# EAGLE board GTM900-breakout_v3 (EAGLE 7.7.0)
VERSION: v3
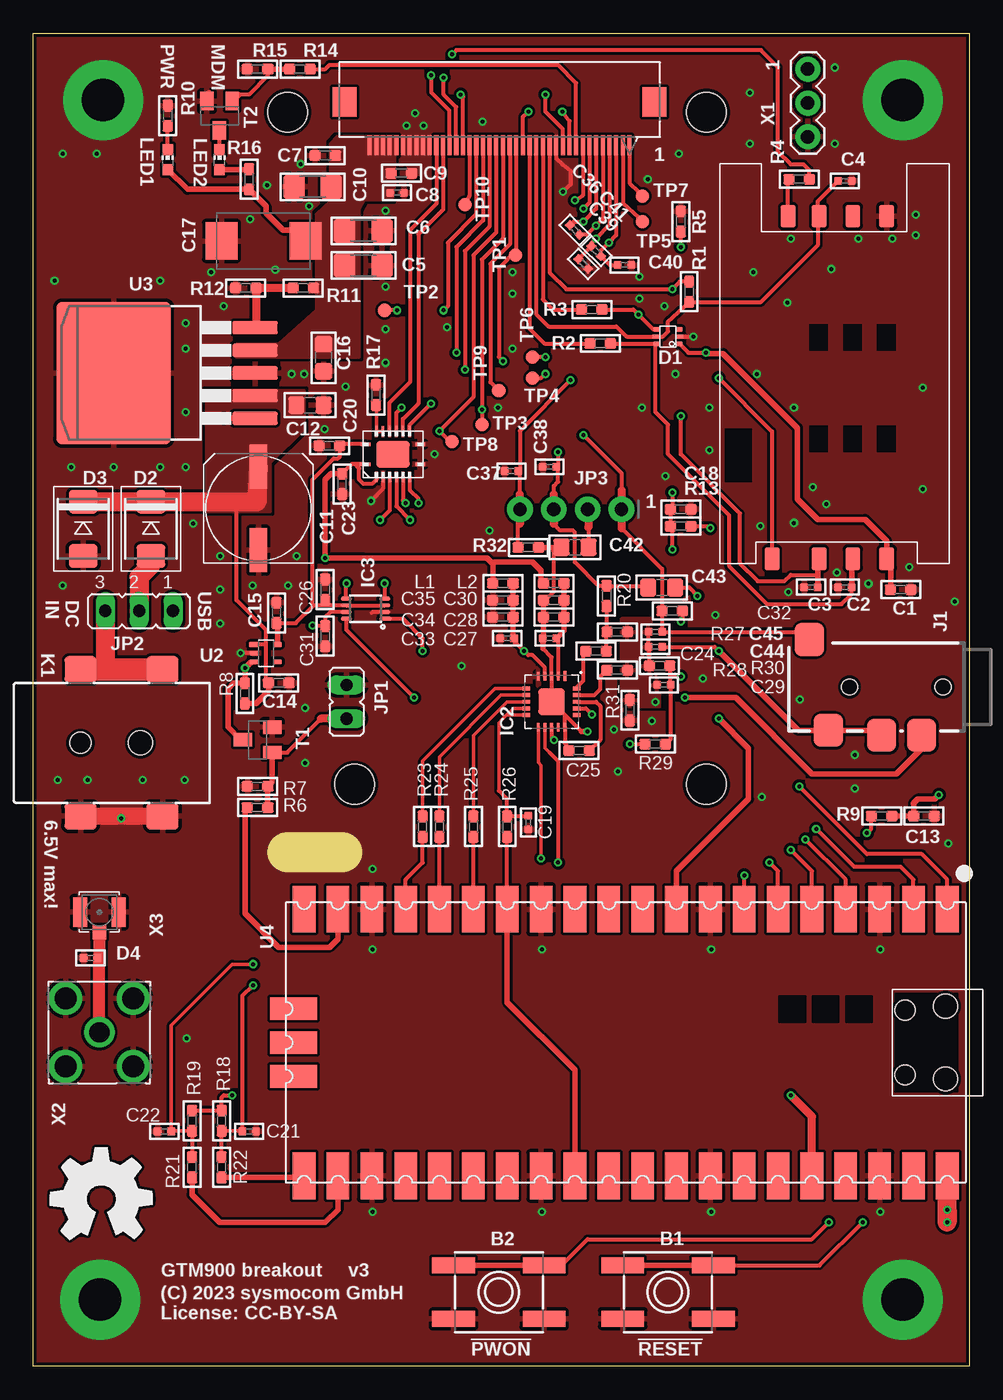
[diagram p2: board, top side]
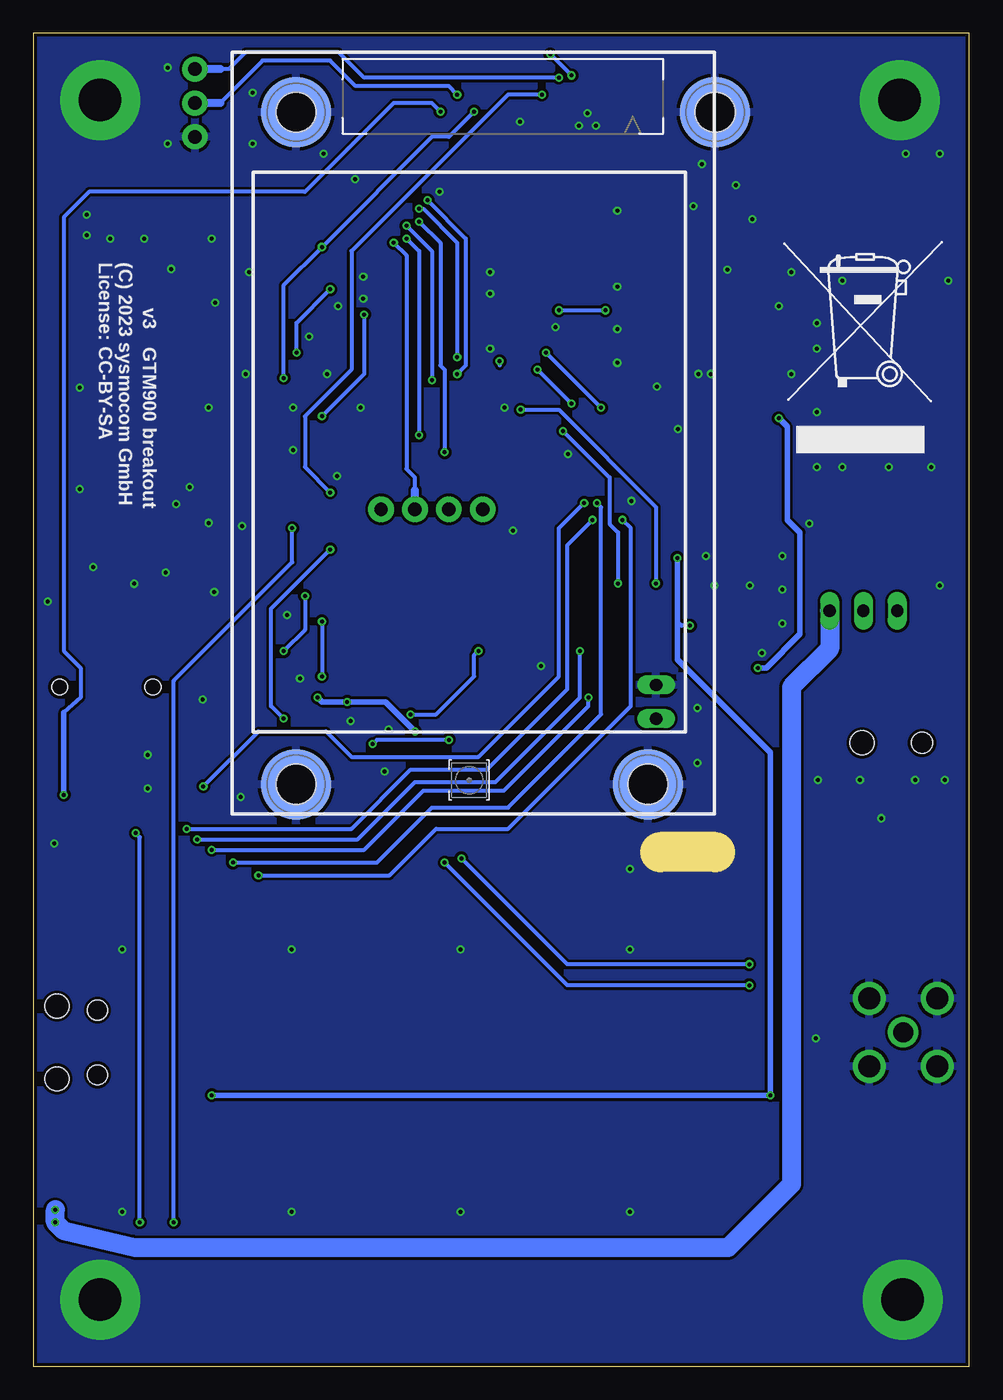
[diagram p3: board, bottom side, seen from below]

Size 70.23 x 100 mm. Coordinates in mm from the lower left corner, seen from the top.
Outline: 70.23,0 0,0 0,100 70.23,100 70.23,0
Copper layers (1*16): Top 0.035mm / dielectric 1.5mm / Bottom 0.035mm
Design rules "SeeedStudio_2layer_DRU_no_angle_20140221 *": minimum track width 6mil, minimum drill 0.3mm, track to track 6mil, track to pad 6mil, pad to pad 6mil, via to via 6mil, smd to smd 0mil, copper to edge 10mil, drill to drill 10mil, minimum pad ring 10mil, minimum via ring 6mil, stop-mask expansion 2mil, vias tented up to drill 100mil, thermal gap 10mil
Net classes: 1 usb: width 0.5 mm, drill 0.15 mm; 2 50 ohm: width 0.9 mm, clearance 0.152 mm; 3 supply: width 0.6 mm, clearance 0.203 mm
Milling: 1 lines

## Footprints (pad centres in the part's own frame; a part is rotated, then mirrored left to right if it is on the bottom)
EVQ-Q2 = smd 3.2 x 1.2: A -3.4,-2; A' 3.4,-2; B -3.4,2; B' 3.4,2
_0603 = smd 0.9 x 0.8: 1 -0.762,0; 2 0.762,0
_0402 = smd 0.6 x 0.6: 1 -0.508,0; 2 0.508,0
1206 = smd 1.6 x 1.8: 1 -1.4,0; 2 1.4,0
UD-8X10_NICHICON = smd 3.3 x 1.3: + 3.125,0; - -3.125,0
_0805 = smd 1.2 x 1.3: 1 -1.016,0; 2 1.016,0
SMC_E = smd 2.4 x 2.8: + -3.15,0; - 3.15,0
SOT666 = smd 0.375 x 0.5: 1 -0.538,-0.85; 3 0.538,-0.85; 4 0.538,0.85; 6 -0.538,0.85 | smd 0.3 x 0.6: 2 0,-0.9; 5 0,0.9
SMBDIODE = smd 1.78 x 2.16: A 2.04,0; C -2.03,0
VQFN-N16 = smd 0.9 x 0.28: 1 -2.091,-0.75 | smd 0.28 x 0.8: 2 -1.25,-1.7; 3 -0.75,-1.7; 4 -0.25,-1.7; 5 0.25,-1.7; 6 0.75,-1.7; 7 1.25,-1.7; 10 1.25,1.7; 11 0.75,1.7; 12 0.25,1.7; 13 -0.25,1.7; 14 -0.75,1.7; 15 -1.25,1.7 | smd 0.8 x 0.28: 8 2.041,-0.75; 9 2.041,0.75; 16 -2.041,0.75 | smd 2.5 x 2: EXP 0,0
QFN20 = smd 0.75 x 0.3: 1 -1.94,1 | smd 0.65 x 0.3: 2 -1.9,0.5; 3 -1.9,0; 4 -1.9,-0.5; 5 -1.9,-1; 11 1.9,-1; 12 1.9,-0.5; 13 1.9,0; 14 1.9,0.5; 15 1.9,1 | smd 0.3 x 0.65: 6 -1,-1.9; 7 -0.5,-1.9; 8 0,-1.9; 9 0.5,-1.9; 10 1,-1.9; 16 1,1.9; 17 0.5,1.9; 18 0,1.9; 19 -0.5,1.9; 20 -1,1.9 | smd 2 x 2: EXP 0,0
VSSOP-8 = smd 0.3 x 0.95: 1 -0.75,-1.5 | smd 0.3 x 0.85: 2 -0.25,-1.45; 3 0.25,-1.45; 4 0.75,-1.45; 5 0.75,1.45; 6 0.25,1.45; 7 -0.25,1.45; 8 -0.75,1.45
AUDIO-JACK-TRRS-SMD = smd 2.2 x 2.5: 1 11.617,-3.567; 2 10.2,3.25; 3 6.2,3.618; 4 3.2,3.618 | hole 1.2: 1.6,0; 8.6,0
JP1 = drill 0.914 long: 1 0,-1.27; 2 0,1.27
JP2 = drill 0.914 long: 1 -2.54,0; 2 0,0; 3 2.54,0
1X04_ROUND_76 = drill 1 pad 1.93: 1 -3.81,0; 2 -1.27,0; 3 1.27,0; 4 3.81,0
694108106102 = smd 2.4 x 2: 1 11.15,5.5; 1-1 5,5.5; 2 5,-5.5; 3 11.15,-5.5 | hole 1.6: 5,0 | hole 1.8: 9.5,0
CHIP-LED0603 = smd 0.8 x 0.8: A 0,-0.75; C 0,0.75
GTM900-WRTHSPACER = smd 5.3 x 5.3: 1 4.5,36.233; 2 4.5,4.8; 3 54.928,31.2; 4 54.928,4.8 | hole 3: 4.5,36.233; 4.5,4.8; 54.928,31.2; 54.928,4.8
SF7W008S1A-RESTR = smd 1.7 x 1.1: 1 12.85,3.9; 2 12.85,1.36; 3 12.85,-1.18; 5 -12.85,3.9; 6 -12.85,1.36; 7 -12.85,-1.18; 81 12.85,-4.7; 82 -12.85,-3.5
SOT23-BEC = smd 1 x 1.4: B -0.95,-1.1; C 0,1.1; E 0.95,-1.1
TP10R = smd 1 x 1: TP 0,0
HIROSE_FH12A-40S-0.5SH(55) = smd 0.305 x 1.499: 1 9.754,3.429; 2 9.246,3.429; 3 8.738,3.429; 4 8.255,3.429; 5 7.747,3.429; 6 7.239,3.429; 7 6.756,3.429; 8 6.248,3.429; 9 5.74,3.429; 10 5.258,3.429; 11 4.75,3.429; 12 4.242,3.429; 13 3.759,3.429; 14 3.251,3.429; 15 2.743,3.429; 16 2.261,3.429; 17 1.753,3.429; 18 1.245,3.429; 19 0.762,3.429; 20 0.254,3.429; 21 -0.254,3.429; 22 -0.762,3.429; 23 -1.245,3.429; 24 -1.753,3.429; 25 -2.261,3.429; 26 -2.743,3.429; 27 -3.251,3.429; 28 -3.759,3.429; 29 -4.242,3.429; 30 -4.75,3.429; 31 -5.258,3.429; 32 -5.74,3.429; 33 -6.248,3.429; 34 -6.756,3.429; 35 -7.239,3.429; 36 -7.747,3.429; 37 -8.255,3.429; 38 -8.738,3.429; 39 -9.246,3.429; 40 -9.754,3.429 | smd 1.803 x 2.21: 41 -11.633,6.68; 42 11.633,6.68
SC70-5 = smd 0.4 x 0.8: 1 -0.65,-0.9 | smd 0.4 x 0.7: 2 0,-0.85; 3 0.65,-0.85; 4 0.65,0.85; 5 -0.65,0.85
TI_KTT_DPAK2 = smd 1 x 3.4: 1 -3.4,-10.6; 2 -1.7,-10.6; 3 0,-10.6; 4 1.7,-10.6; 5 3.4,-10.6 | smd 10.7 x 8.6: PAD 0,0
PICO-PKG-SMD = smd 3.5 x 1.7: P$1 -10,24.13; P$2 -10,21.59; P$3 -10,19.05; P$4 -10,16.51; P$5 -10,13.97; P$6 -10,11.43; P$7 -10,8.89; P$8 -10,6.35; P$9 -10,3.81; P$10 -10,1.27; P$11 -10,-1.27; P$12 -10,-3.81; P$13 -10,-6.35; P$14 -10,-8.89; P$15 -10,-11.43; P$16 -10,-13.97; P$17 -10,-16.51; P$18 -10,-19.05; P$19 -10,-21.59; P$20 -10,-24.13; P$21 10,-24.13; P$22 10,-21.59; P$23 10,-19.05; P$24 10,-16.51; P$25 10,-13.97; P$26 10,-11.43; P$27 10,-8.89; P$28 10,-6.35; P$29 10,-3.81; P$30 10,-1.27; P$31 10,1.27; P$32 10,3.81; P$33 10,6.35; P$34 10,8.89; P$35 10,11.43; P$36 10,13.97; P$37 10,16.51; P$38 10,19.05; P$39 10,21.59; P$40 10,24.13 | smd 1.7 x 3.5: P$41 -2.54,-24.925; P$42 0,-24.925; P$43 2.54,-24.925 | hole 1.8: -2.725,24; 2.725,24 | hole 1.5: -2.425,20.97; 2.425,20.97
1X03 = drill 1.016 pad 1.88: 1 0,0; 2 2.54,0; 3 5.08,0
SMA-F-S-TH = drill 1.524: C 0,0 | drill 1.651: G1 -2.54,2.54; G2 2.54,2.54; G3 -2.54,-2.54; G4 2.54,-2.54
HRS_UFL = smd 1.05 x 2.2: GND@1 -1.452,0; GND@2 1.452,0 | smd 1 x 1.05: SIG 0,-1.502

## Placement (x,y rotation side)
B1  [EVQ-Q2]  47.62,5.56 180 top
B2  [EVQ-Q2]  34.92,5.55 180 top
C1  100n  [_0603]  65.09,58.26 180 top
C2  33p  [_0402]  60.9,58.45 180 top
C3  33p  [_0402]  58.36,58.45 180 top
C4  33p  [_0402]  60.9,88.93 0 top
C5  100u  [1206]  24.77,82.58 180 top
C6  100u  [1206]  24.77,85.18 180 top
C7  100n  [_0603]  21.91,90.83 0 top
C8  33p  [_0402]  27.3,88.04 0 top
C9  10p  [_0603]  27.62,89.5 0 top
C10  100u  [1206]  20.95,88.48 0 top
C11  470u  [UD-8X10_NICHICON]  16.89,64.35 90 top
C12  10u  [_0805]  20.76,72.1 180 top
C13  100n  [_0603]  66.83,41.27 0 top
C14  1u  [_0603]  18.41,51.27 180 top
C15  1u  [_0603]  18.25,56.52 270 top
C16  10u  [_0805]  21.78,75.66 90 top
C17  DNP  [SMC_E]  17.27,84.42 180 top
C18  100n  [_0603]  48.58,64.29 0 top
C19  33p  [_0402]  37.15,40.8 270 top
C20  100n  [_0603]  22.23,69.05 180 top
C21  33p  [_0402]  16.2,17.62 0 top
C22  33p  [_0402]  9.84,17.62 180 top
C23  100n  [_0603]  23.18,66.19 90 top
C24  100n  [_0603]  42.23,53.65 0 top
C25  4.7u  [_0603]  40.96,46.19 0 top
C26  100n  [_0603]  21.91,58.27 90 top
C27  33p  [_0402]  38.73,54.61 180 top
C28  100n  [_0603]  39.05,56.2 180 top
C29  33p  [_0402]  47.31,51.12 180 top
C30  4.7u  [_0603]  39.05,57.47 180 top
C31  100n  [_0603]  21.91,54.77 90 top
C32  100n  [_0603]  47.94,56.67 0 top
C33  33p  [_0402]  35.56,54.61 180 top
C34  100n  [_0603]  35.24,56.2 180 top
C35  4.7u  [_0603]  35.24,57.47 180 top
C36  33p  [_0402]  40.64,85.25 135 top
C37  33p  [_0402]  38.73,67.47 180 top
C38  33p  [_0402]  35.88,67.16 0 top
C39  33p  [_0402]  41.27,82.7 315 top
C40  33p  [_0402]  44.36,82.61 0 top
C41  33p  [_0402]  42.23,83.66 315 top
C42  10u  [_0805]  40.64,61.44 180 top
C43  10u  [_0805]  47.15,58.42 180 top
C44  33p  [_0402]  46.67,53.97 0 top
C45  33p  [_0402]  46.67,55.09 180 top
D1  PESD5V0UBV  [SOT666]  47.62,77.24 90 top
D2  ACDBB540-HF  [SMBDIODE]  8.83,62.83 270 top
D3  SMBJP6KE6.8A-TP  [SMBDIODE]  3.75,62.83 270 top
D4  GG040205170N2P  [_0402]  4.29,30.64 0 top
IC1  SN74AVC4T245-VQFN  [VQFN-N16]  26.99,68.42 0 top
IC2  NAU88C10  [QFN20]  38.89,49.85 270 top
IC3  TXB0102  [VSSOP-8]  24.93,56.83 90 top
J1  AUDIO-JACK3  [AUDIO-JACK-TRRS-SMD]  69.85,50.95 180 top
JP1  [JP1]  23.5,49.85 0 top
JP2  [JP2]  7.94,56.67 180 top
JP3  [1X04_ROUND_76]  40.32,64.29 180 top
K1  PJ-002BH-SMT-TR  [694108106102]  -1.46,46.76 0 top
L1  47nH  [_0603]  35.24,58.74 0 top
L2  47nH  [_0603]  39.05,58.74 0 top
LED1  GREEN  [CHIP-LED0603]  10.1,90.52 0 top
LED2  YELLOW  [CHIP-LED0603]  13.97,90.52 0 top
MDM1  GTM900-BM2-SPACER  [GTM900-WRTHSPACER]  55.31,98.58 270 bottom
R1  15k  [_0603]  49.21,80.61 90 top
R2  47  [_0603]  42.55,76.74 0 top
R3  47  [_0603]  41.91,79.28 0 top
R4  4.7k  [_0603]  57.47,89.06 0 top
R5  47k  [_0603]  48.58,85.88 270 top
R6  22k  [_0603]  16.83,41.91 0 top
R7  22k  [_0603]  16.83,43.5 180 top
R8  4.7k  [_0603]  15.88,50.48 270 top
R9  1k  [_0603]  63.66,41.27 180 top
R10  330  [_0603]  10.1,93.82 270 top
R11  200k  [_0603]  20.26,80.9 0 top
R12  22k  [_0603]  15.94,80.9 180 top
R13  1k  [_0603]  48.58,63.02 0 top
R14  22k  [_0603]  20,97.31 180 top
R15  22k  [_0603]  16.83,97.31 180 top
R16  330  [_0603]  16.19,89.06 90 top
R17  0  [_0603]  25.72,72.86 90 top
R18  4,7k  [_0603]  14.13,18.41 90 top
R19  4,7k  [_0603]  11.91,18.41 90 top
R20  22k  [_0603]  43.02,57.78 270 top
R21  220  [_0603]  11.9,14.92 270 top
R22  220  [_0603]  14.12,14.92 270 top
R23  220  [_0603]  29.21,40.48 270 top
R24  220  [_0603]  30.48,40.48 270 top
R25  220  [_0603]  33.02,40.48 270 top
R26  220  [_0603]  35.56,40.48 270 top
R27  1k  [_0603]  43.82,55.09 0 top
R28  1k  [_0603]  43.81,52.23 0 top
R29  22k  [_0603]  46.67,46.67 0 top
R30  1k  [_0603]  46.99,52.55 180 top
R31  0  [_0603]  44.77,49.21 270 top
R32  0  [_0603]  37.15,61.43 180 top
SIM1  SF7W008S1A-R  [SF7W008S1A-RESTR]  60.13,73.43 270 top
T1  BC847  [SOT23-BEC]  16.83,46.99 90 top
T2  BC847  [SOT23-BEC]  13.97,93.82 180 top
TP1  TPTP10R  [TP10R]  36.2,83.34 0 top
TP2  TPTP10R  [TP10R]  26.35,79.21 0 top
TP3  TPTP10R  [TP10R]  33.66,70.64 0 top
TP4  TPTP10R  [TP10R]  37.47,74.13 180 top
TP5  TPTP10R  [TP10R]  45.72,85.88 180 top
TP6  TPTP10R  [TP10R]  37.47,75.72 180 top
TP7  TPTP10R  [TP10R]  45.72,87.78 180 top
TP8  TPTP10R  [TP10R]  31.43,69.37 0 top
TP9  TPTP10R  [TP10R]  34.92,73.18 0 top
TP10  TPTP10R  [TP10R]  32.38,87.15 0 top
U1  FH12A-40S-0.5SH(55)  [HIROSE_FH12A-40S-0.5SH(55)]  34.99,88.17 0 top
U2  MIC5366  [SC70-5]  17.46,53.49 270 top
U3  MCP1827T-ADJE/ET  [TI_KTT_DPAK2]  6.03,74.51 90 top
U4  RASPBERRY_PICOSMD  [PICO-PKG-SMD]  44.45,24.29 270 top
U$2  [WEEE_BIN]  8.57,75.08 0 bottom
U$3  [OSHW_8MM_COPPER]  5.08,12.54 0 top
X1  [1X03]  58.1,97.31 270 top
X2  [SMA-F-S-TH]  4.95,25.05 90 top
X3  [HRS_UFL]  4.95,34.06 0 top

## Tracks (layer width: path | path; a pad name or v marks a point on that pad's centre or on a via)
!MODEM_LDO_ON
  Top 0.406: R6.1 15.88,41.78 15.88,33.97 18.41,31.43 22.23,31.43 22.86,32.07 U4.P$19
!PWON  (via drill 0.3)
  Top 0.305: U1.26 32.24,95.23 v32.07,95.41 | v47.94,65.56 47.94,64.48 C18.1 R13.1 47.94,62.89 v47.94,61.28
  Top 0.406: U4.P$9 48.26,37.15 53.66,42.55 53.66,46.35 v51.44,48.58
  Bottom 0.305: v32.07,95.41 34.61,95.41 46.35,83.66 46.35,74.77 49.85,71.28 49.85,67.47 v47.94,65.56 | v51.44,48.58 52.39,49.53 52.39,56.83 v47.94,61.28
!RST  (via drill 0.3)
  Top 0.305: U1.10 40.25,93.42 v39.69,94.14
  Top 0.406: C13.1 66.19,41.4 | C13.1 66.19,41.15 | R9.1 C13.1 | v67.94,42.86 67.63,42.55 66.36,42.55 66.04,42.23 66.07,42.2 C13.1
  Bottom 0.305: v39.69,94.14 40.32,94.77 43.18,94.77 49.85,88.1 66.04,88.1 67.94,86.2 67.94,53.66 66.67,52.39 66.67,50.16 67.94,49.05
  Bottom 0.406: v67.94,42.86 67.94,49.05
_RXD2  (via drill 0.3)
  Top 0.305: U4.P$7 v53.34,36.83 | IC1.4 26.74,64.2 v26.04,63.5
  Bottom 0.305: v53.34,36.83 43.5,36.83 40.01,40.32 34.61,40.32 25.4,49.53 25.4,62.87 v26.04,63.5
_TXD2  (via drill 0.3)
  Top 0.305: U4.P$6 55.88,37.15 v55.24,37.78 | IC1.6 27.74,64.97 v27.94,64.77
  Bottom 0.305: v55.24,37.78 44.45,37.78 40.32,41.91 34.61,41.91 27.62,48.9 27.62,64.45 v27.94,64.77
_UART_CTS  (via drill 0.3)
  Top 0.305: U4.P$4 60.96,36.51 v57.94,39.53 | v29.21,53.66 29.21,54.61 27.74,56.08 IC3.1
  Bottom 0.305: v57.94,39.53 45.88,39.53 41.59,43.81 35.56,43.81 29.21,50.16 v29.21,53.66
_UART_RTS  (via drill 0.3)
  Top 0.305: U4.P$5 58.42,37.15 v56.83,38.73 | v28.57,50.16 23.5,55.24 23.5,56.06 IC3.8
  Bottom 0.305: v56.83,38.73 45.4,38.73 40.96,43.18 34.92,43.18 28.57,49.53 v28.57,50.16
_UART_RXD  (via drill 0.3)
  Top 0.305: U4.P$2 66.04,36.51 65.09,37.47 61.59,37.47 v58.74,40.32 | v28.26,63.5 27.24,64.52 IC1.5
  Bottom 0.305: v58.74,40.32 46.35,40.32 41.91,44.77 36.2,44.77 30.16,50.8 30.16,61.59 v28.26,63.5
_UART_TXD  (via drill 0.3)
  Top 0.305: U4.P$1 68.58,36.51 66.67,38.42 62.55,38.42 v57.47,43.5 | v28.89,64.77 28.89,65.09 28.24,65.74 IC1.7
  Bottom 0.305: v57.47,43.5 53.34,47.62 48.26,47.62 46.35,45.72 36.83,45.72 30.8,51.75 30.8,62.87 v28.89,64.77
_USIM_CLK
  Top 0.305: U1.14 38.24,80.03 38.99,79.28 R3.1
_USIM_RESET
  Top 0.305: U1.16 37.25,77.84 38.35,76.74 R2.1
ADC  (via drill 0.3)
  Top 0.305: U1.27 31.74,94.47 30.8,95.41 v30.8,96.67
  Bottom 0.305: v30.8,96.67 45.4,96.67 47.31,98.58 54.29,98.58 55.56,97.31 56.2,97.31
  Bottom 0.61: 56.2,97.31 X1.1
AGND  (via drill 0.3)
  Top 0.305: 38.23,53.85 38.89,53.19 IC2.3 IC2.EXP 39.89,48.85 | 39.89,48.85 IC2.15 39.89,46.75 C25.1 | C29.2 46.67,51.12 | 46.35,52.42 R30.2 46.23,54.07 C44.1 C45.2 | 44.58,55.25 R27.2 | C30.2 38.42,57.47 39.05,58.1 39.05,61.19 | J1.4 66.65,46.33 | 39.89,48.85 39.73,49.01 41.12,47.62
  Top 0.406: 66.65,46.33 64.77,44.45 58.42,44.45 52.7,50.16 v48.9,50.16 | 41.12,47.62 v41.59,47.62 | 38.23,53.85 C27.2 38.29,54.67 C28.2 C30.2 | R32.1 39.05,61.43 | 39.05,61.43 C42.2 | 39.05,61.19 39.05,61.43
  Bottom 0.406: v48.9,50.16 48.58,49.85 v46.67,49.85 43.81,49.85 v41.59,47.62
  pour Top: 44.13,49.53 46.99,49.53 46.99,51.44 46.35,52.07 46.35,56.04 44.13,56.04
AUXI+
  Top 0.152: 45.4,86.2 45.72,86.2 TP5.TP
  Top 0.305: U1.2 44.23,87.25 45.4,86.2
AUXI-
  Top 0.152: 45.4,88.1 45.72,88.1 TP7.TP
  Top 0.305: U1.1 44.74,88.76 45.4,88.1
AUXO+  (via drill 0.3)
  Top 0.305: U1.8 41.24,87.82 v40.64,87.47 | TP4.TP 38.1,74.13 v38.42,74.45
  Bottom 0.305: v40.64,87.47 37.78,84.61 37.78,75.08 v38.42,74.45
AUXO-  (via drill 0.3)
  Top 0.305: U1.7 41.74,87.3 v41.27,86.83 | v38.42,75.72 TP6.TP
  Bottom 0.305: v41.27,86.83 40.96,86.83 38.42,84.29 v38.42,75.72
EAR+  (via drill 0.3)
  Top 0.305: U1.6 42.23,86.83 v41.27,85.88 40.56,85.88 C36.2 | v39.37,68.58 39.37,67.6 C37.1 39.37,67.35 39.37,66.36 39.05,66.04 39.05,65.41 | C43.2 46.01,58.55 R20.1 42.42,58.55 40.64,60.33 40.64,62.55 40.48,62.71 39.53,62.71 39.05,63.18
  Top 0.6: 39.05,65.41 JP3.3 39.05,63.18
  Bottom 0.305: v41.27,85.88 39.69,84.29 39.69,75.08 39.37,74.77 v39.37,68.58
EAR-  (via drill 0.3)
  Top 0.305: U1.5 42.74,86.07 v42.23,85.56 41.55,84.89 C36.1 | v40.32,73.98 36.51,70.17 36.51,67.28 C38.2 36.51,67.03 36.51,65.41 | R32.2 36.39,63.06 36.51,63.18
  Top 0.6: JP3.4 36.51,63.18
  Top 0.61: JP3.4 36.51,65.41
  Bottom 0.305: v42.23,85.56 40.32,83.66 v40.32,73.98 40.32,73.81
GND  (via drill 0.3, 3.2 pad 6)
  Top 0.305: D1.2 v49.53,77.24 | U2.2 v15.56,53.49 | U1.12 39.23,90.63 39.69,90.17 40.32,89.69 40.32,88.67 v39.75,88.1 | IC3.2 25.47,56.58 25.4,56.52 | IC1.3 26.24,65.83 v25.34,64.92
  Top 0.406: T2.E 13.21,95.55
  Top 1.27: K1.2 K1.3
  other vias: 2.22,90.96 4.76,90.96 48.45,90.96 4.06,43.97 1.84,43.97 65.23,5 65.23,95 5.23,95 65.72,59.97 62.67,58.7 60.29,59.56 56.64,58.07 58.48,65.94 59.5,64.67 57.09,63.27 54.29,74.45 57.09,71.91 66.23,86.39 66.23,84.86 61.91,84.61 56.83,84.61 54.04,82.07 59.88,82.32 56.58,79.78 12,63.21 66.74,73.43 66.74,65.81 5,5 28,93.06 29.27,93.06 28.64,94.01 26.42,80.99 26.42,86.71 19.37,74.45 13.34,74.45 20.32,74.45 14.29,79.53 11.43,78.26 11.43,76.36 11.43,71.59 6.03,67.47 14.03,60.8 14.03,58.26 19.75,60.8 9.53,81.44 13.34,82.07 11.43,67.47 9.53,67.47 2.86,67.47 1.59,81.44 35.94,76.36 35.94,80.48 35.94,82.07 69.15,57.37 45.47,80.1 50.74,71.91 45.66,71.91 48.2,74.45 50.74,68.73 33.72,93.37 53.78,91.72 53.78,95.53 60.13,97.44 60.13,91.72 64.45,84.61 46.1,89.06 47.37,79.53 45.47,81.75 23.43,73.5 31.05,77.94 26.42,77.82 26.42,75.28 34.86,71.91 34.23,62.7 18.16,82.26 16.26,86.07 20.7,87.02 17.53,88.61 20.07,90.2 54.55,63.02 47.43,66.77 8.19,43.97 11.37,43.97 6.6,41.11 2.22,58.58 19.11,58.58 14.03,55.72 43.56,47.78 30.1,68.42 46.42,48.41 57.53,50 54.67,42.7 43.88,44.6 20.38,45.24 20.38,49.37 32.13,52.54 51.18,56.35 68.64,39.21 50.23,51.59 61.66,45.88 61.66,43.34 21.84,70.32 16.45,58.58 25.46,37.3 25.46,11.59 38.16,11.59 50.86,11.59 50.86,31.27 63.56,31.27 38.16,31.27 25.46,31.27 63.56,11.59 11.49,24.6
  pour Top (rank 6): 70.23,99.85 0.19,99.85 0.19,0 70.23,0
  pour Bottom (rank 6): 70.23,99.85 0.19,99.85 0.19,0 70.23,0
  pour Top (no thermals): 27.78,93.5 27.78,90.33 28.26,89.85 28.26,89.69 29.53,89.69 29.84,90.33 29.84,93.5
LDO_IN
  Top 0.305: 17.46,54.13 17.46,51.46 C14.2 17.34,51.46 | 17.46,54.13 16.58,54.13 U2.1 | 17.46,54.13 17.46,55.24 15.24,57.47 15.24,64.86
  Top 0.406: R8.2 16.7,49.72 17.65,50.67 C14.2
  Top 1.422: D3.C D2.C 15.24,64.86 16.76,64.86 16.83,64.92 16.83,65.83 C11.+
  pour Top (no thermals): 13.02,73.18 20.32,73.18 20.32,70.32 17.78,67.78 17.78,64.13 13.02,64.13
LPG
  Top 0.305: U1.9 40.73,96.27 39.37,97.63 22.23,97.63 21.91,97.31 R14.1
MIC+  (via drill 0.3)
  Top 0.305: U1.4 43.24,85.63 v42.23,84.61 41.87,84.25 C41.1 C39.1 | v41.27,69.85 44.13,66.99 44.13,65.72 | 44.13,62.87 47.18,59.82 C32.1 C45.1 57.66,55.09 J1.1
  Top 0.6: JP3.1 44.13,62.87
  Top 0.61: 44.13,65.72 JP3.1
  Bottom 0.305: v42.23,84.61 41.27,83.66 v41.27,69.85 41.27,69.69
MIC-  (via drill 0.3)
  Top 0.305: U1.3 43.73,84.84 v43.18,84.29 42.59,83.7 C41.2 43.27,82.61 C40.1 | 41.66,64.23 JP3.2 | 41.66,62.93 C42.1
  Top 0.6: 41.66,64.23 41.66,62.93
  Bottom 0.305: v43.18,84.29 42.23,83.34 42.23,67.31 41.59,66.67 41.59,65.72
  Bottom 0.61: JP3.2 41.59,65.72
MODEM_LDO_ON  (via drill 0.3)
  Top 0.406: T1.C 15.56,46.99 14.61,47.94 14.61,50.8 15.05,51.24 R8.1 v15.88,52.39 16.33,52.84 U2.3 | v14.29,71.12 U3.1
  Bottom 0.406: v15.88,52.39 15.24,52.39 12.7,54.93 12.7,62.55 13.65,63.5 13.65,70.48 v14.29,71.12
N$1
  Top 0.305: LED1.C R10.2
N$2
  Top 0.406: LED2.A 16.19,89.77 R16.2
N$3
  Top 0.305: LED2.C T2.C
N$4
  Top 1.422: JP2.3 5.4,52.26
  Top 1.676: K1.1 5.4,52.26 K1.1-1
N$5
  Top 0.305: R15.1 17.59,96.8 16.19,95.41 15.41,95.41
  Top 0.406: 15.41,95.41 T2.B | R15.1 R14.2
N$6
  Top 0.406: 16.7,77.98 U3.5
  Top 0.61: R11.1 R12.1 16.7,77.98
N$7
  Top 0.305: C24.2 42.99,55.18 R27.1 43.02,55.12 R20.2
N$8  (via drill 0.3)
  Top 0.305: C44.2 51.12,53.98 v51.44,53.65 | C43.1 49.21,58.42 v49.85,57.78
  Top 0.406: J1.3 63.28,47.7 J1.2 57.39,47.7 v51.44,53.65
  Bottom 0.305: v49.85,57.78 49.85,55.24 v51.44,53.65
N$9  (via drill 0.3)
  Top 0.305: B2.A 39.62,7.55 41.59,9.53 58.42,9.53 v59.69,10.79 | R13.2 50.65,63.02 v50.8,62.87
  Top 0.406: B2.A' B2.A
  Bottom 0.305: v59.69,10.79 59.69,51.44 50.8,60.33 v50.8,62.87
N$10
  Top 0.305: 56.63,88.73 R4.1 56.63,88.98 SIM1.82
N$11
  Top 0.254: 34.92,43.18 34.92,48.26 35.24,48.58 35.51,48.85 | 35.51,48.85 36.01,49.35 IC2.9 | IC2.10 35.51,48.85
  Top 0.305: C19.1 37.15,41.24 R26.1 35.56,42.55 34.92,43.18
N$12
  Top 0.254: R25.1 33.02,47.31 35.56,49.85 IC2.8
N$13
  Top 0.305: 4.95,30.48 D4.2 4.95,30.79
  Top 0.9: X2.C 4.95,30.48 4.95,30.64 | X3.SIG 4.95,30.79
N$14
  Top 0.254: R24.1 30.48,45.72 35.11,50.35 IC2.7
N$15
  Top 0.254: R23.1 29.21,45.4 34.66,50.85 IC2.6
N$16  (via drill 0.3)
  Top 0.305: 47.82,51.75 C29.1 47.82,47.05 R29.2 | 47.82,51.75 47.82,52.49 R30.1 | C32.2 48.7,56.01 v48.58,55.88 | v48.58,51.75 47.82,51.75
  Bottom 0.305: v48.58,55.88 v48.58,51.75
N$17
  Top 0.305: 21.59,48.58 19.05,46.04 T1.B
  Top 0.406: R6.2 R7.1 17.93,43.84 T1.B 18.09,46.04
  Top 0.6: JP1.1 21.59,48.58
N$18
  Top 0.305: IC2.19 42.09,50.35 42.55,50.8 42.55,51.75 R28.1
N$19
  Top 1.422: D2.A 8.83,60.1 7.94,59.21 JP2.2
N$20  (via drill 0.3)
  Top 0.305: IC2.4 38.39,52.41 37.47,53.34 37.15,53.34 v36.83,53.66 36.2,54.29 | IC2.17 41.46,49.35 v41.91,48.9
  Top 0.406: L1.2 C35.1 C34.1 36.01,54.67 C33.1 36.2,54.48 36.2,54.29
  Bottom 0.305: v41.91,48.9 40.01,48.9 37.15,51.75 37.15,53.34 v36.83,53.66
N$21  (via drill 0.3)
  Top 0.305: B1.A 58.99,7.56 v62.23,10.79 | v62.55,40.01 62.87,40.32 62.87,41.25 R9.2
  Top 0.406: B1.A' B1.A
  Bottom 0.305: v62.23,10.79 62.23,39.69 v62.55,40.01
N$22
  Top 0.254: IC1.14 IC1.15 25.74,72.08 R17.1
N$24
  Top 0.305: IC2.2 39.39,54.46 C27.1
  Top 0.406: L2.2 C30.1 C28.1 39.81,55.18 C27.1
N$25  (via drill 0.3)
  Top 0.254: R18.1 15.66,17.65 C21.1 | IC2.12 38.39,46.38 38.73,46.04
  Top 0.305: R22.1 R18.1 | C21.1 15.69,27.81 v16.51,28.57 | 38.73,46.04 39.37,45.4 v39.37,37.78
  Bottom 0.305: v16.51,28.57 30.16,28.57 v39.37,37.78
N$26  (via drill 0.3)
  Top 0.254: R19.1 10.38,17.65 C22.1 10.35,25.59 14.92,30.16 v16.51,30.16 | IC2.11 37.89,45.3 38.1,45.09 v38.1,38.1
  Top 0.305: R19.1 11.91,15.69 R21.1
  Bottom 0.305: v16.51,30.16 30.16,30.16 v38.1,38.1
N$28
  Top 0.305: C25.2 41.75,46.19 42.55,46.99 42.55,49.53 42.23,49.85 IC2.18
N$30  (via drill 0.3)
  Top 0.305: IC2.13 38.89,47.15 v39.05,46.99 | v44.77,46.67 R29.1
  Bottom 0.305: v39.05,46.99 44.45,46.99 v44.77,46.67
N$31
  Top 0.305: IC2.20 40.79,50.95 41.27,51.44 41.27,53.78 C24.1
PCM_CLK_RP2
  Top 0.305: U4.P$14 R26.2
  Top 0.406: U4.P$14 35.56,27.3 40.64,22.23 U4.P$29
PCM_FRAME_RP2
  Top 0.305: U4.P$15 R25.2
PCM_MISO_RP2
  Top 0.305: U4.P$17 27.94,36.51 29.21,37.78 R23.2
PCM_MOSI_RP2
  Top 0.305: U4.P$16 R24.2
RXD2
  Top 0.305: U1.30 30.24,87.23 28.26,85.25 28.26,73.81 26.74,72.3 IC1.13
SCL
  Top 0.406: R21.2 11.9,12.86 13.97,10.79 21.91,10.79 22.86,11.75 U4.P$22
SDA
  Top 0.406: R22.2 20.2,14.16 U4.P$21
TXD2
  Top 0.305: U1.29 30.75,86.78 28.89,84.93 28.89,72.23 27.74,71.07 IC1.11
UART_CTS  (via drill 0.3)
  Top 0.305: U1.21 34.73,85.06 33.02,83.34 33.02,72.71 v30.48,70.17 31.28,69.37 TP8.TP | IC3.4 26.38,58.71 v26.35,58.74
  Bottom 0.305: v30.48,70.17 26.99,66.67 26.99,63.18 26.35,62.55 v26.35,58.74
UART_DCD  (via drill 0.3)
  Top 0.305: U1.18 36.23,83.7 | 36.23,83.7 34.92,82.39 34.92,75.72 v35.24,75.4 | 36.23,83.7 36.23,83.38 TP1.TP
  Bottom 0.305: v35.24,75.4 35.24,75.08
UART_DSR
  Top 0.305: U1.25 32.73,87.81 TP10.TP
UART_DTR
  Top 0.305: U1.19 35.75,84.17 34.29,82.7 34.29,73.81 TP9.TP
UART_RI  (via drill 0.3)
  Top 0.305: U1.24 33.24,86.41 31.11,84.29 31.11,79.53 v30.8,79.21 | v27.3,79.21 TP2.TP
  Bottom 0.305: v30.8,79.21 v27.3,79.21
UART_RTS  (via drill 0.3)
  Top 0.305: U1.20 35.24,84.61 33.66,83.02 v33.66,71.75 TP3.TP | IC3.5 23.48,58.72 v23.5,58.74
  Bottom 0.305: v33.66,71.75 30.8,71.75 23.5,64.45 v23.5,58.74
UART_RXD  (via drill 0.3)
  Top 0.305: U1.23 33.74,85.97 31.75,83.97 v31.75,76.04 | IC1.12 27.24,71.53 v27.62,71.91
  Bottom 0.305: v31.75,76.04 v27.62,71.91
UART_TXD  (via drill 0.3)
  Top 0.305: U1.22 34.23,85.5 32.38,83.66 v32.38,74.77 | IC1.10 28.24,70.62 v29.84,72.23
  Bottom 0.305: v32.38,74.77 v29.84,72.23
USB_VBUS  (via drill 0.3)
  Top 1.422: v68.58,11.75 v68.58,10.79 U4.P$40
  Bottom 1.422: JP2.1 10.48,53.81 13.34,50.95 13.34,13.65 18.1,8.89 62.55,8.89 67.94,10.16 v68.58,10.79 v68.58,11.75
USIM_CD  (via drill 0.3)
  Top 0.305: v51.44,74.13 55.43,70.13 SIM1.81 | v48.58,83.97 R5.2 | U1.17 36.74,93.73 v37.15,94.14
  Bottom 0.305: v51.44,74.13 51.44,81.12 v48.58,83.97 40.32,92.23 39.05,92.23 v37.15,94.14
USIM_CLK  (via drill 0.3)
  Top 0.305: v48.58,71.28 48.58,68.42 53.02,63.97 53.02,60.23 54.36,58.89 56.35,58.89 56.83,59.37 58.86,59.37 | R3.2 45.02,79.28 v45.4,78.89 46.52,77.78 D1.4
  Top 0.406: SIM1.3 58.86,60.49 58.86,59.37 C3.1
  Bottom 0.305: v45.4,78.89 45.4,74.45 v48.58,71.28
USIM_IO
  Top 0.305: U1.15 37.73,78.95 38.67,78.01 43.75,78.01 44.51,77.24 D1.5 47.24,77.24 47.62,77.62 47.62,78.39 R1.1 54.61,79.85 58.86,84.1 58.86,86.37 58.86,87.4 C4.1
  Top 0.307: SIM1.7 58.86,86.37
USIM_RESET
  Top 0.305: 61.4,57.94 C2.1 | R2.2 43.34,76.71 D1.6 46.67,76.6 46.67,71.59 47.62,70.64 47.62,68.42 52.2,63.85 52.2,60.03 55.05,57.18
  Top 0.307: 55.05,57.18 60.64,57.18 61.4,57.94
  Top 0.406: SIM1.2 61.4,60.49 C2.1
USIM_VCC  (via drill 0.3)
  Top 0.305: U1.13 38.75,82.06 40.01,80.8 v47.94,80.8 48.51,81.37 R1.2 | 50.48,75.97 v50.48,76.04 49.14,76.04 D1.1
  Top 0.406: 50.48,75.97 51.75,75.97 57.34,70.39 57.34,65.05 58.86,63.53 62.42,63.53 64.03,61.91 SIM1.1 64.33,60.29 C1.2
  Top 0.6: SIM1.1 64.2,60.42
  Bottom 0.305: v50.48,76.04 50.48,78.26 v47.94,80.8
VBACKUP  (via drill 0.3)
  Top 0.305: U1.11 39.74,92.81 38.42,94.14 v38.42,95.41
  Bottom 0.305: v38.42,95.41 39.05,96.04 46.04,96.04 47.94,97.94 53.02,97.94 56.2,94.77
  Bottom 0.61: 56.2,94.77 X1.2
VCC  (via drill 0.3)
  Top 0.305: IC1.1 24.13,67.67 | 24.13,67.67 23.89,67.67 C23.2 | IC1.2 25.74,66.53 25.4,66.19 24.77,66.19 24.45,66.51 24.45,67.35 24.13,67.67 | R19.2 R18.2 14.13,20.16 14.29,20.32 v14.92,20.32 | 24.74,60.61 24.77,60.64 | v20.95,55.56 20.98,55.53 C31.2 21.91,56.2 22.29,56.58 IC3.7 | 38.1,58.93 L2.1
  Top 0.406: C23.2 22.35,66.96 21.91,66.51 v21.91,60.64 24.77,60.64 34.04,60.64 34.48,60.2 | 38.1,58.93 38.1,59.69 37.47,60.33 34.61,60.33 34.48,60.2 | L1.1 34.48,60.2
  Top 0.6: U4.P$36 58.42,18.73 v56.83,20.32
  Bottom 0.305: v20.95,55.56 21.59,55.56 21.91,55.88
  Bottom 0.406: v56.83,20.32 v14.92,20.32 14.92,46.04 21.91,53.02 21.91,55.88 v21.91,60.64
VCC_4V1
  Top 0.406: LED1.A 11.57,88.29 R16.1 17.46,87.02 17.46,86.52 18.73,85.25 20,85.25 20,84.84 C17.+
  Top 0.61: 20.61,84.29 C17.+
  pour Top (no thermals): 22.8,92.23 27.11,92.23 27.11,88.67 26.92,87.53 24.83,87.53 24.45,86.83 24.45,75.72 15.24,75.72 15.24,76.67 18.41,76.67 21.27,79.21 21.27,86.42 22.29,87.4 22.29,91.72
VDD  (via drill 0.3)
  Top 0.305: v29.84,96.84 29.84,95.57 31.23,94.18 U1.28 | v31.43,98.42 31.75,98.74 54.61,98.74 55.88,97.47 55.88,91.12 56.83,90.17 57.78,90.17 58.23,89.72 R4.2 58.1,88.9
  Bottom 0.305: v31.43,98.42 v29.84,96.84
VIO_2V8
  Top 0.305: IC1.16 23.1,69.17 C20.1 22.99,68.23 22.86,68.1 22.54,68.1 20.95,66.51 20.95,57.15 21.02,57.08 | IC3.3 IC3.6 21.91,57.08 | 21.91,57.08 21.02,57.08 | C26.1 21.91,57.08 | C15.2 19.69,55.75 21.02,57.08
  Top 0.406: U2.5 18.31,55.63 C15.2

## Text on the board
tPlace: 1 | 1 | 1
tNames: PWR | MDM | USB | DC / IN | 6.5V max! | GTM900 breakout | (C) 2023 sysmocom GmbH / License: CC-BY-SA | !PWON | !RESET
bNames: (C) 2023 sysmocom GmbH / License: CC-BY-SA | GTM900 breakout